# EAGLE schematic pridge (EAGLE 5.11)
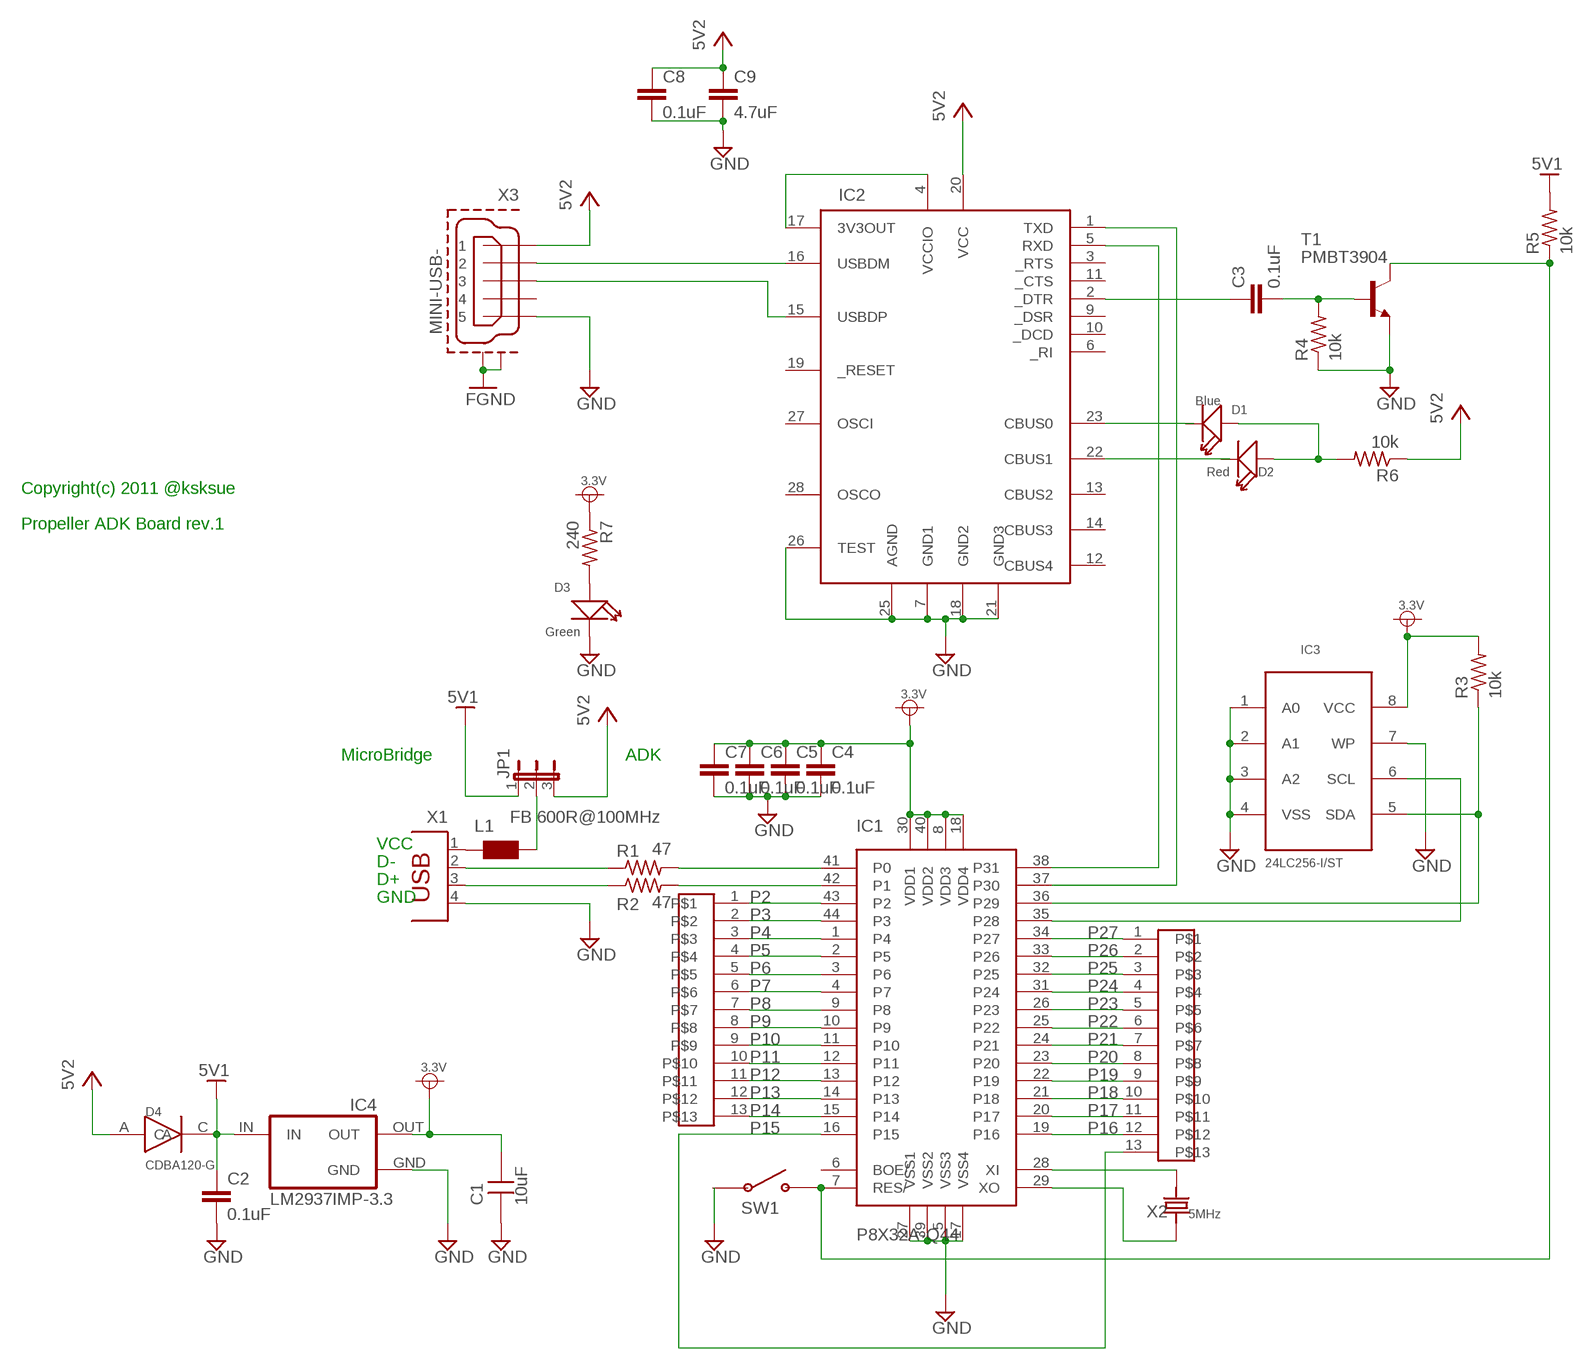
[diagram p0: schematic, sheet 1]

## Parts
C1  10uF  CAPSM3216  [C3216]
C2  0.1uF  C-EUC2012  [C2012]
C3  0.1uF  C-EUC2012  [C2012]
C4  0.1uF  C-EUC2012  [C2012]
C5  0.1uF  C-EUC2012  [C2012]
C6  0.1uF  C-EUC2012  [C2012]
C7  0.1uF  C-EUC2012  [C2012]
C8  0.1uF  C-EUC2012  [C2012]
C9  4.7uF  C-EUC2012  [C2012]
CN1  P13-2.45  [13P-2.54]
CN2  P13-2.45  [13P-2.54]
D1  Blue  LED'0603'  [LED-0603]
D2  Red  LED'0603'  [LED-0603]
D3  Green  LED'0603'  [LED-0603]
D4  CDBA120-G  [DO214AC]
IC1  P8X32A-Q44  [P8X32A-Q44]
IC2  FT232RL  [SSOP28DB]
IC3  24LC256-I/ST  [TSSOP8]
IC4  LM2937IMP-3.3  [SOT223]
JP1  JP2E  [JP2]
L1  FB 600R@100MHz  WE-CBF_0805  [0805]
R1  47  R-US_R0402  [R0402]
R2  47  R-US_R0402  [R0402]
R3  10k  R-US_R0402  [R0402]
R4  10k  R-US_R0402  [R0402]
R5  10k  R-US_R0402  [R0402]
R6  10k  R-US_R0402  [R0402]
R7  240  R-US_R0402  [R0402]
SW1  TL1015BF160QG  [TL1015BF160QG]
T1  PMBT3904  [SOT23]
X1  PN87520  [PN87520]
X2  5MHz  CRYSTAL-HC49S  [HC49/S]
X3  MINI-USB-  [USB-MINI-B-THROUGH]

## Nets
GND: C1.1 C2.2 C4.2 C5.2 C6.2 C7.2 C8.2 C9.2 D3.- IC1.5(VSS3) IC1.17(VSS4) IC1.27(VSS1) IC1.39(VSS2) IC2.7(GND1) IC2.18(GND2) IC2.21(GND3) IC2.25(AGND) IC2.26(TEST) IC3.1(A0) IC3.2(A1) IC3.3(A2) IC3.4(VSS) IC3.7(WP) IC4.GND R4.1 T1.2(E) X1.4 X3.GND X3.M1(GND1) X3.M2(GND2) ; supply symbol labelled FGND
N$1: IC1.37(P30) IC2.1(TXD)
N$2: IC1.38(P31) IC2.5(RXD)
N$3: IC1.41(P0) R1.2
N$4: R1.1 X1.2
N$5: IC2.4(VCCIO) IC2.17(3V3OUT)
N$6: R2.1 X1.3
N$7: IC1.42(P1) R2.2
N$8: IC1.35(P28) IC3.6(SCL)
N$9: IC1.36(P29) IC3.5(SDA) R3.1
N$10: IC1.28(XI) X2.2
N$11: IC1.29(XO) X2.1
N$12: C3.1 IC2.2(_DTR)
N$13: C3.2 R4.2 T1.1(B)
N$14: IC1.7(RES/) R5.1 SW1.P$2 T1.3(C)
N$15: IC2.16(USBDM) X3.D-
N$16: IC2.15(USBDP) X3.D+
N$17: IC2.23(CBUS0)
N$18: IC2.22(CBUS1)
N$19: IC1.40(VDD2)
N$20: IC1.8(VDD3)
N$21: D1.+ D2.+ R6.2
N$22: C6.1
N$23: C5.1
N$24: C4.1
N$25: D3.+ R7.2
N$26: JP1.2 L1.2
N$27: L1.1 X1.1
P2: CN1.1 IC1.43(P2)
P3: CN1.2 IC1.44(P3)
P4: CN1.3 IC1.1(P4)
P5: CN1.4 IC1.2(P5)
P6: CN1.5 IC1.3(P6)
P7: CN1.6 IC1.4(P7)
P8: CN1.7 IC1.9(P8)
P9: CN1.8 IC1.10(P9)
P10: CN1.9 IC1.11(P10)
P11: CN1.10 IC1.12(P11)
P12: CN1.11 IC1.13(P12)
P13: CN1.12 IC1.14(P13)
P14: CN1.13 IC1.15(P14)
P15: CN2.13 IC1.16(P15)
P16: CN2.12 IC1.19(P16)
P17: CN2.11 IC1.20(P17)
P18: CN2.10 IC1.21(P18)
P19: CN2.9 IC1.22(P19)
P20: CN2.8 IC1.23(P20)
P21: CN2.7 IC1.24(P21)
P22: CN2.6 IC1.25(P22)
P23: CN2.5 IC1.26(P23)
P24: CN2.4 IC1.31(P24)
P25: CN2.3 IC1.32(P25)
P26: CN2.2 IC1.33(P26)
P27: CN2.1 IC1.34(P27)
VCC: C1.2 C2.1 C7.1 C8.1 C9.1 D4.A D4.C IC1.18(VDD4) IC1.30(VDD1) IC2.20(VCC) IC3.8(VCC) IC4.IN IC4.OUT JP1.1 JP1.3 R3.2 R5.2 R6.1 R7.1 X3.VBUS ; supply symbol labelled 3.3V, 5V1, 5V2
Unconnected: D1.- D2.- IC1.6(BOE/) IC2.3(_RTS) IC2.6(_RI) IC2.9(_DSR) IC2.10(_DCD) IC2.11(_CTS) IC2.12(CBUS4) IC2.13(CBUS2) IC2.14(CBUS3) IC2.19(_RESET) IC2.27(OSCI) IC2.28(OSCO) SW1.P$1 X3.ID

## Notes on the sheet
- Copyright(c) 2011 @ksksue
- Propeller ADK Board rev.1
- MicroBridge | ADK
- VCC
- D-
- D+
- GND

## Power pins joined to a net without a drawn wire
GND: IC4.GND@(GND)

## Library data of the parts
C1 = MyLib:CAP: Non polar capacitor
C2-C9 = resistor:C-EU: CAPACITOR, European symbol
CN1 CN2 = ksksue2:P13-2.45
D1-D3 = Discrete:LED*
D4 = ksksue2:CDBA120-G
IC1 = ksksue2:P8X32A-Q44: Propeller 44pin-LQFP
IC2 = ftdichipVin:FT232RL: USB UART 4th Generation USB UART (USB <-> Serial) Controller
IC3 = ksksue:24LC256-I/ST: EEPROM I2C 8-TSSOP 256KB 2.5-5.5V
IC4 = ksksue:LM2937IMP-*: 400 and 500 mA Low Dropout Voltage Regulator NATIONAL SEMICONDUCTOR created by Peter.Hofmann@ph-tronic.de <mailto:Reter.Hofmann@ph-tronic.de> 10-2004 Rev.0
JP1 = jumper:JP2E: JUMPER
L1 = wuerth-elektronik:WE-CBF: SMD EMI Suppression Ferrite Beads - excellent anti-EMI properties - low DCR - impedances till 3000 ohms - rated current up to 6 A
R1 R2 = resistor:R-US_: RESISTOR, American symbol
R3-R7 = rcl:R-US_: RESISTOR, American symbol
SW1 = ksksue:TL1015BF160QG
T1 = ksksue:PMBT3904: PMBT3904 NPN TRANSISTOR
X1 = con-berg:PN87520: BERG USB connector; OC_FARNELL: unknown; OC_NEWARK: unknown
X2 = ksksue:CRYSTAL*: CRYSTAL ECS-50-20-4 Digikey:X410-ND
X3 = ksksue2:MINI-USB-: MINI USB Through-hole Connector http://www.molex.com/pdm_docs/sd/548190519_sd.pdf